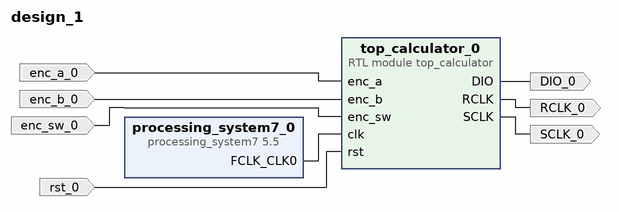
[diagram p0: block diagram of the top level]
# Vivado block design design_1, xc7z020clg400-1, Vivado 2025.1
create_bd_design design_1

create_bd_port -dir O DIO_0
create_bd_port -dir O RCLK_0
create_bd_port -dir O SCLK_0
create_bd_port -dir I enc_a_0
create_bd_port -dir I enc_b_0
create_bd_port -dir I enc_sw_0
create_bd_port -dir I -type rst rst_0

create_bd_cell -type ip -vlnv xilinx.com:ip:processing_system7:5.5 processing_system7_0
set_property -dict [list \
  CONFIG.PCW_EN_RST0_PORT 0 \
  CONFIG.PCW_UIPARAM_DDR_ENABLE 0 \
  CONFIG.PCW_USE_M_AXI_GP0 0 \
] [get_bd_cells processing_system7_0]
# 30 more settings of processing_system7_0 are not shown: defaults, MIO pin electricals, DDR timing, and values the tool derives
create_bd_cell -type module -reference top_calculator top_calculator_0

# ---- connections ----

connect_bd_net -net enc_a_0_1 [get_bd_ports enc_a_0] [get_bd_pins top_calculator_0/enc_a]
connect_bd_net -net enc_b_0_1 [get_bd_ports enc_b_0] [get_bd_pins top_calculator_0/enc_b]
connect_bd_net -net enc_sw_0_1 [get_bd_ports enc_sw_0] [get_bd_pins top_calculator_0/enc_sw]
connect_bd_net [get_bd_pins processing_system7_0/FCLK_CLK0] [get_bd_pins top_calculator_0/clk]
connect_bd_net -net rst_0_1 [get_bd_ports rst_0] [get_bd_pins top_calculator_0/rst]
connect_bd_net [get_bd_pins top_calculator_0/DIO] [get_bd_ports DIO_0]
connect_bd_net [get_bd_pins top_calculator_0/RCLK] [get_bd_ports RCLK_0]
connect_bd_net [get_bd_pins top_calculator_0/SCLK] [get_bd_ports SCLK_0]

validate_bd_design
save_bd_design
